# EAGLE design ProtoOne-v1 (EAGLE 7.3.0)
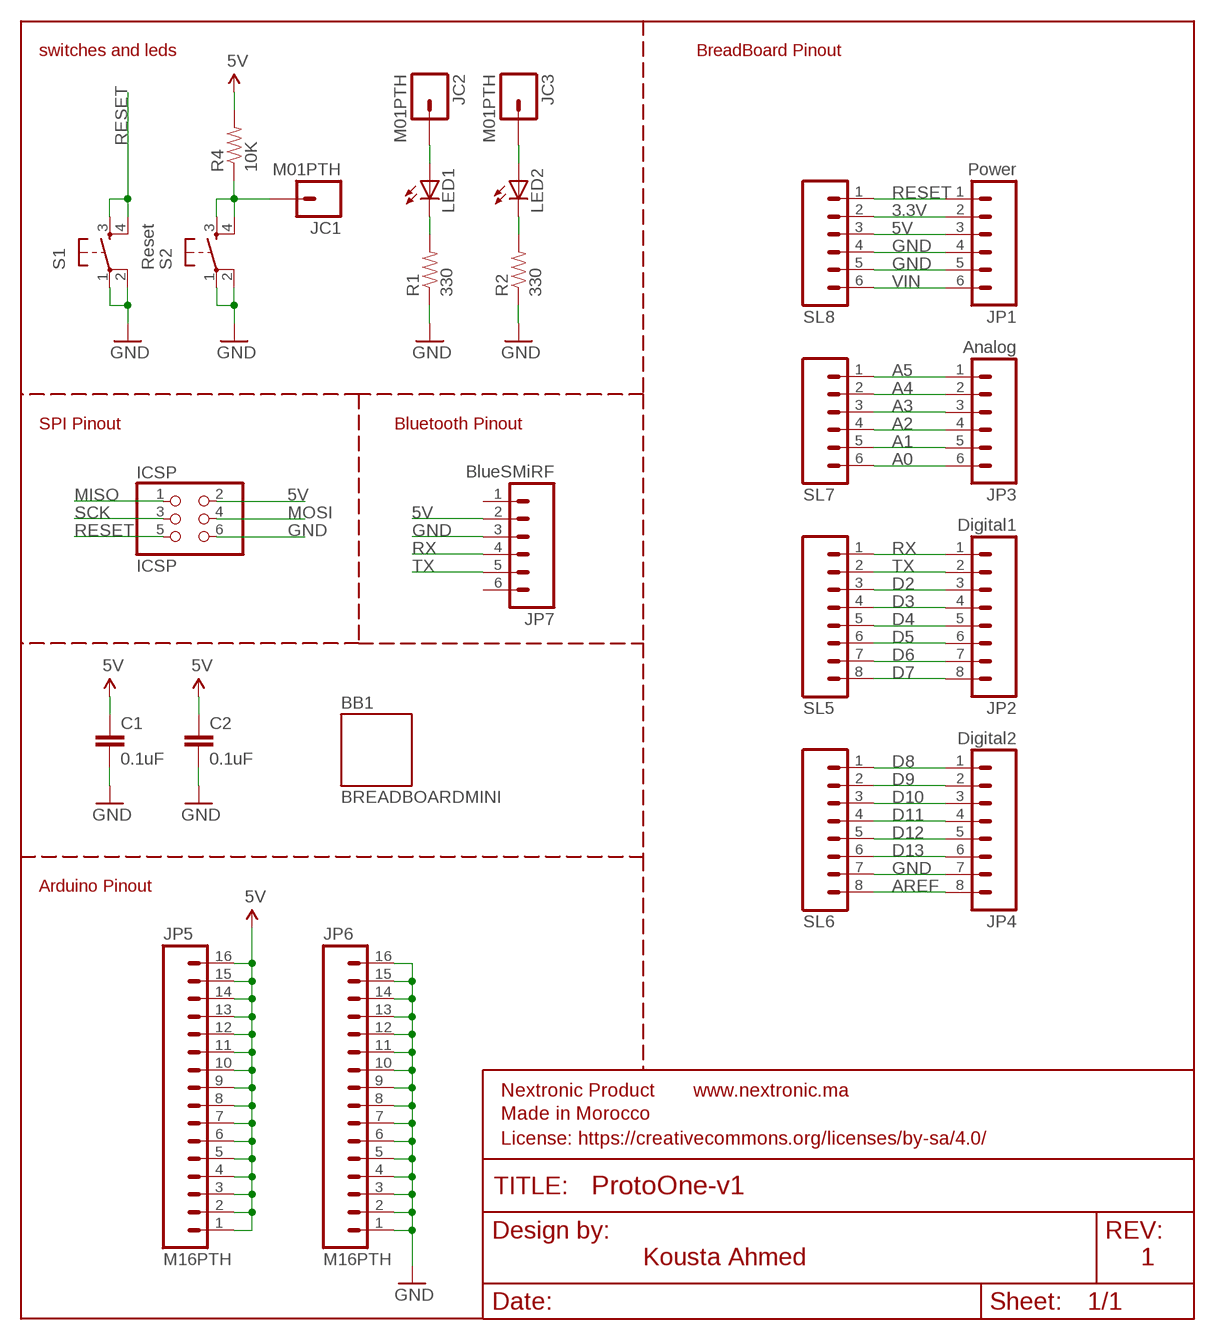
[diagram p0: schematic, sheet 1]

## Parts
BB1  BREADBOARDMINI  [BREADBOARD-MINI]
C1  0.1uF  CAPPTH2  [CAP-PTH-SMALL2]
C2  0.1uF  CAPPTH2  [CAP-PTH-SMALL2]
FRAME1  FRAME-LETTER  [CREATIVE_COMMONS]
ICSP  ICSP  PINHD-2X3  [2X03]
JC1  M01PTH  [1X01]
JC2  M01PTH  [1X01]
JC3  M01PTH  [1X01]
JP1  Power  M06SIP  [1X06]
JP2  Digital1  M08  [1X08]
JP3  Analog  M06SIP  [1X06]
JP4  Digital2  M08  [1X08]
JP5  M16PTH  [1X16]
JP6  M16PTH  [1X16]
JP7  BlueSMiRF  M06SIP  [1X06]
LED1  LED5MM  [LED5MM]
LED2  LED5MM  [LED5MM]
R1  330  RESISTORPTH1  [AXIAL-0.3]
R2  330  RESISTORPTH1  [AXIAL-0.3]
R4  10K  RESISTORPTH1  [AXIAL-0.3]
S1  Reset  TAC_SWITCHPTH  [TACTILE-PTH]
S2  TAC_SWITCHPTH  [TACTILE-PTH]
SL5  M08  [1X08]
SL6  M08  [1X08]
SL7  M06SIP  [1X06]
SL8  M06SIP  [1X06]

## Nets
3.3V: JP1.2 SL8.2
5V [power]: C1.1 C2.1 ICSP.2 JP1.3 JP5.1 JP5.2 JP5.3 JP5.4 JP5.5 JP5.6 JP5.7 JP5.8 JP5.9 JP5.10 JP5.11 JP5.12 JP5.13 JP5.14 JP5.15 JP5.16 JP7.2 R4.P$2 SL8.3
A0: JP3.6 SL7.6
A1: JP3.5 SL7.5
A2: JP3.4 SL7.4
A3: JP3.3 SL7.3
A4: JP3.2 SL7.2
A5: JP3.1 SL7.1
AREF: JP4.8 SL6.8
D2: JP2.3 SL5.3
D3: JP2.4 SL5.4
D4: JP2.5 SL5.5
D5: JP2.6 SL5.6
D6: JP2.7 SL5.7
D7: JP2.8 SL5.8
D8: JP4.1 SL6.1
D9: JP4.2 SL6.2
D10: JP4.3 SL6.3
D11: JP4.4 SL6.4
D12: JP4.5 SL6.5
D13: JP4.6 SL6.6
GND [power]: C1.2 C2.2 ICSP.6 JP1.4 JP1.5 JP4.7 JP6.1 JP6.2 JP6.3 JP6.4 JP6.5 JP6.6 JP6.7 JP6.8 JP6.9 JP6.10 JP6.11 JP6.12 JP6.13 JP6.14 JP6.15 JP6.16 JP7.3 R1.P$1 R2.P$1 S1.1 S1.2 S2.1 S2.2 SL6.7 SL8.4 SL8.5
MISO: ICSP.1
MOSI: ICSP.4
N$2: JC1.1 R4.P$1 S2.3 S2.4
N$6: LED1.K(C) R1.P$2
N$7: LED2.K(C) R2.P$2
N$8: JC2.1 LED1.A
N$9: JC3.1 LED2.A
RESET: ICSP.5 JP1.1 S1.3 S1.4 SL8.1
RX: JP2.1 JP7.4 SL5.1
SCK: ICSP.3
TX: JP2.2 JP7.5 SL5.2
VIN [power]: JP1.6 SL8.6
Unconnected: JP7.1 JP7.6

## Notes on the sheet
- switches and leds | BreadBoard Pinout
- SPI Pinout | Bluetooth Pinout
- Arduino Pinout
- Kousta Ahmed | 1

## Library data of the parts
BB1 = SparkFun:BREADBOARD: Breadboard Mini Self Adhesive This is the mechnical outline for the very small self adhesive breadboard from SparkFun Electronics. Good for very small proto areas. SKU : PRT-07916; OC_FARNELL: unknown
C1 C2 = SparkFun:CAP: Capacitor Standard 0603 ceramic capacitor, and 0.1" leaded capacitor.; MF: MULTICOMP; MPN: MC0805B104K500A5.08MM; OC_FARNELL: 2395773
FRAME1 = SparkFun-Aesthetics:FRAME-LETTER: Schematic Frame Standard 8.5x11 US Letter frame; OC_FARNELL: unknown
ICSP = pinhead:PINHD-2X3: PIN HEADER; OC_FARNELL: unknown
JC1-JC3 = SparkFun:M01: Header 1 Standard 1-pin 0.1" header. Use with straight break away headers (SKU : PRT-00116), right angle break away headers (PRT-00553), swiss pins (PRT-00743), machine pins (PRT-00117), and female headers (PRT-00115).; OC_FARNELL: unknown
JP1 JP3 JP7 SL7 SL8 = SparkFun:M06: Header 6 Standard 6-pin 0.1" header. Use with straight break away headers (SKU : PRT-00116), right angle break away headers (PRT-00553), swiss pins (PRT-00743), machine pins (PRT-00117), and female headers (PRT-00115). Molex polarized connector foot print use with SKU : PRT-08094 with associated crimp pins and housings. NOTES ON THE VARIANTS LOCK and LOCK_LONGPADS... This footprint was designed to help hold the alignment of a through-hole component (i.e. 6-pin header) while soldering it into place. You may notice that each hole has been shifted either up or down by 0.005 of an inch from it's more standard position (which is a perfectly straight line). This slight alteration caused the pins (the squares in the middle) to touch the edges of the holes. Because they are alternating, it causes a "brace" to hold the component in place. 0.005 has proven to be the perfect amount of "off-center" position when using our standard breakaway headers. Although looks a little odd when you look at the bare footprint, once you have a header in there, the alteration is very hard to notice. Also, if you push a header all the way into place, it is covered up entirely on the bottom side. This idea of altering the position of holes to aid alignment will be further integrated into the Sparkfun Library for other footprints. It can help hold any component with 3 or more connection pins.; OC_FARNELL: unknown
JP2 JP4 SL5 SL6 = SparkFun:M08: Header 8 Standard 8-pin 0.1" header. Use with straight break away headers (SKU : PRT-00116), right angle break away headers (PRT-00553), swiss pins (PRT-00743), machine pins (PRT-00117), and female headers (PRT-00115).; OC_FARNELL: unknown
JP5 JP6 = SparkFun:M16; OC_FARNELL: unknown
LED1 LED2 = SparkFun:LED: LEDs Standard schematic elements and footprints for 5mm, 3mm, 1206, and 0603 sized LEDs. 5mm - Spark Fun Electronics SKU : COM-00529 (and others); OC_FARNELL: unknown
R1 R2 = SparkFun:RESISTOR: Resistor Basic schematic elements and footprints for 0603, 1206, and PTH 1/10th watt (small) resistors.; OC_FARNELL: unknown
R4 = SparkFun:RESISTOR: Resistor Basic schematic elements and footprints for 0603, 1206, and PTH 1/10th watt (small) resistors.; MF: SUSUMU; MPN: RR0816P-103-B-T5; OC_FARNELL: 1653253
S1 S2 = SparkFun:TAC_SWITCH: Momentary Switch Button commonly used for reset or general input. Spark Fun Electronics SKU : COM-00097; OC_FARNELL: unknown

## Net classes
1 power: width 0.254 mm

## Board
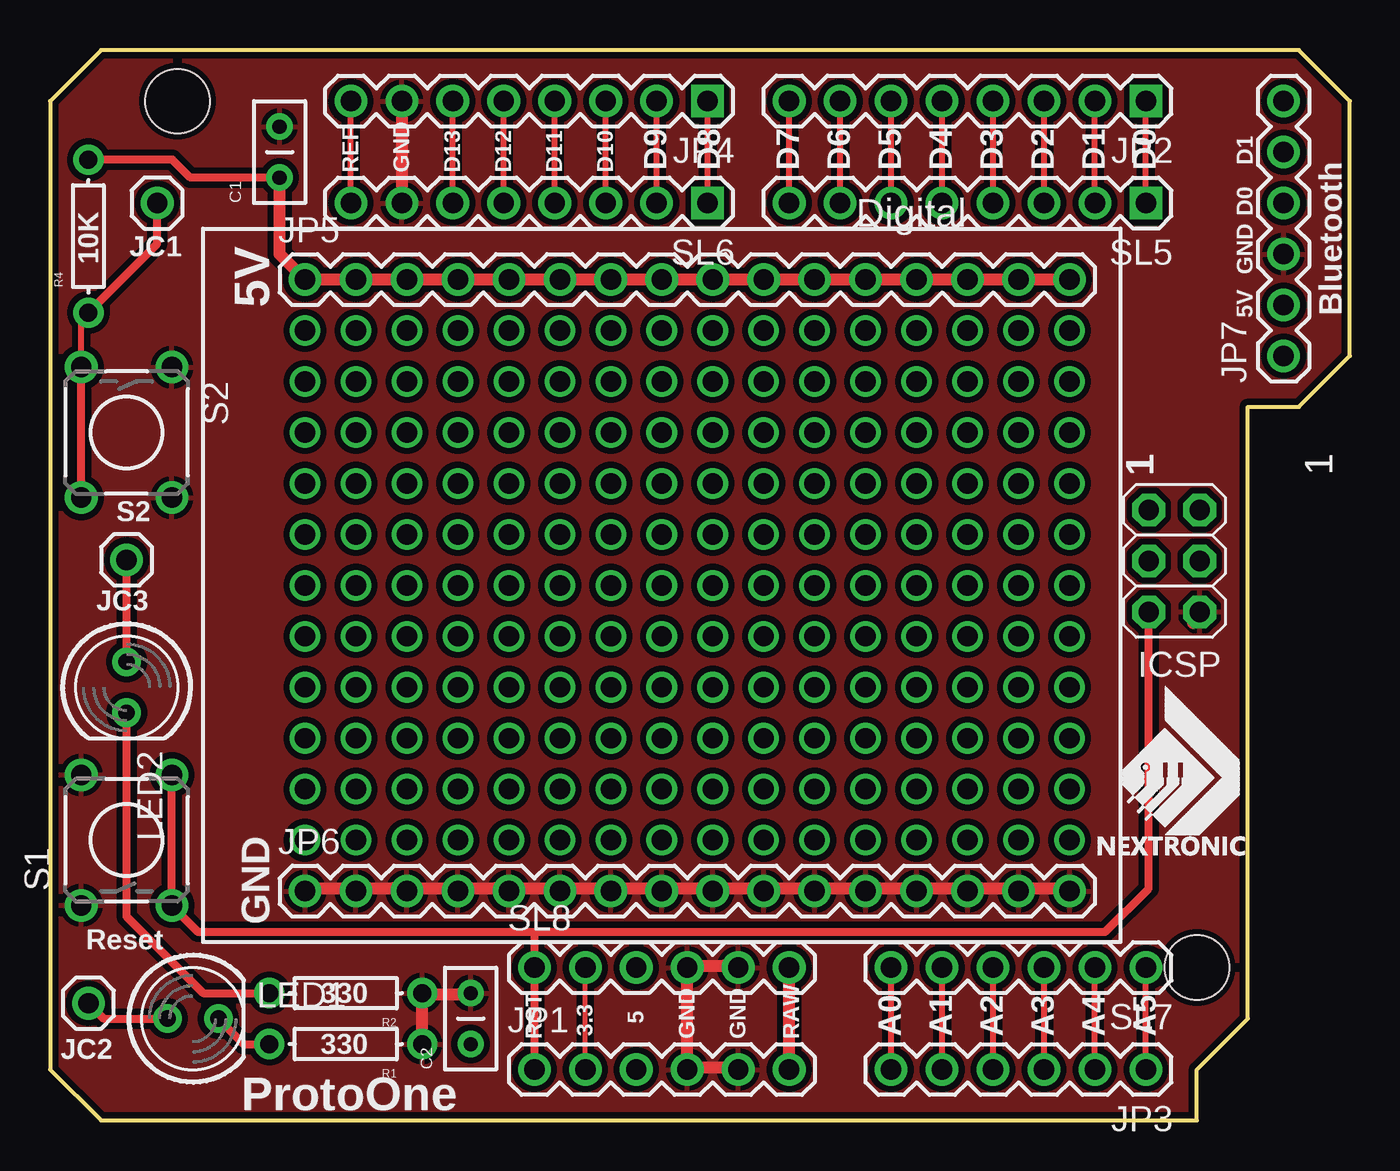
[diagram p1: board, top side]
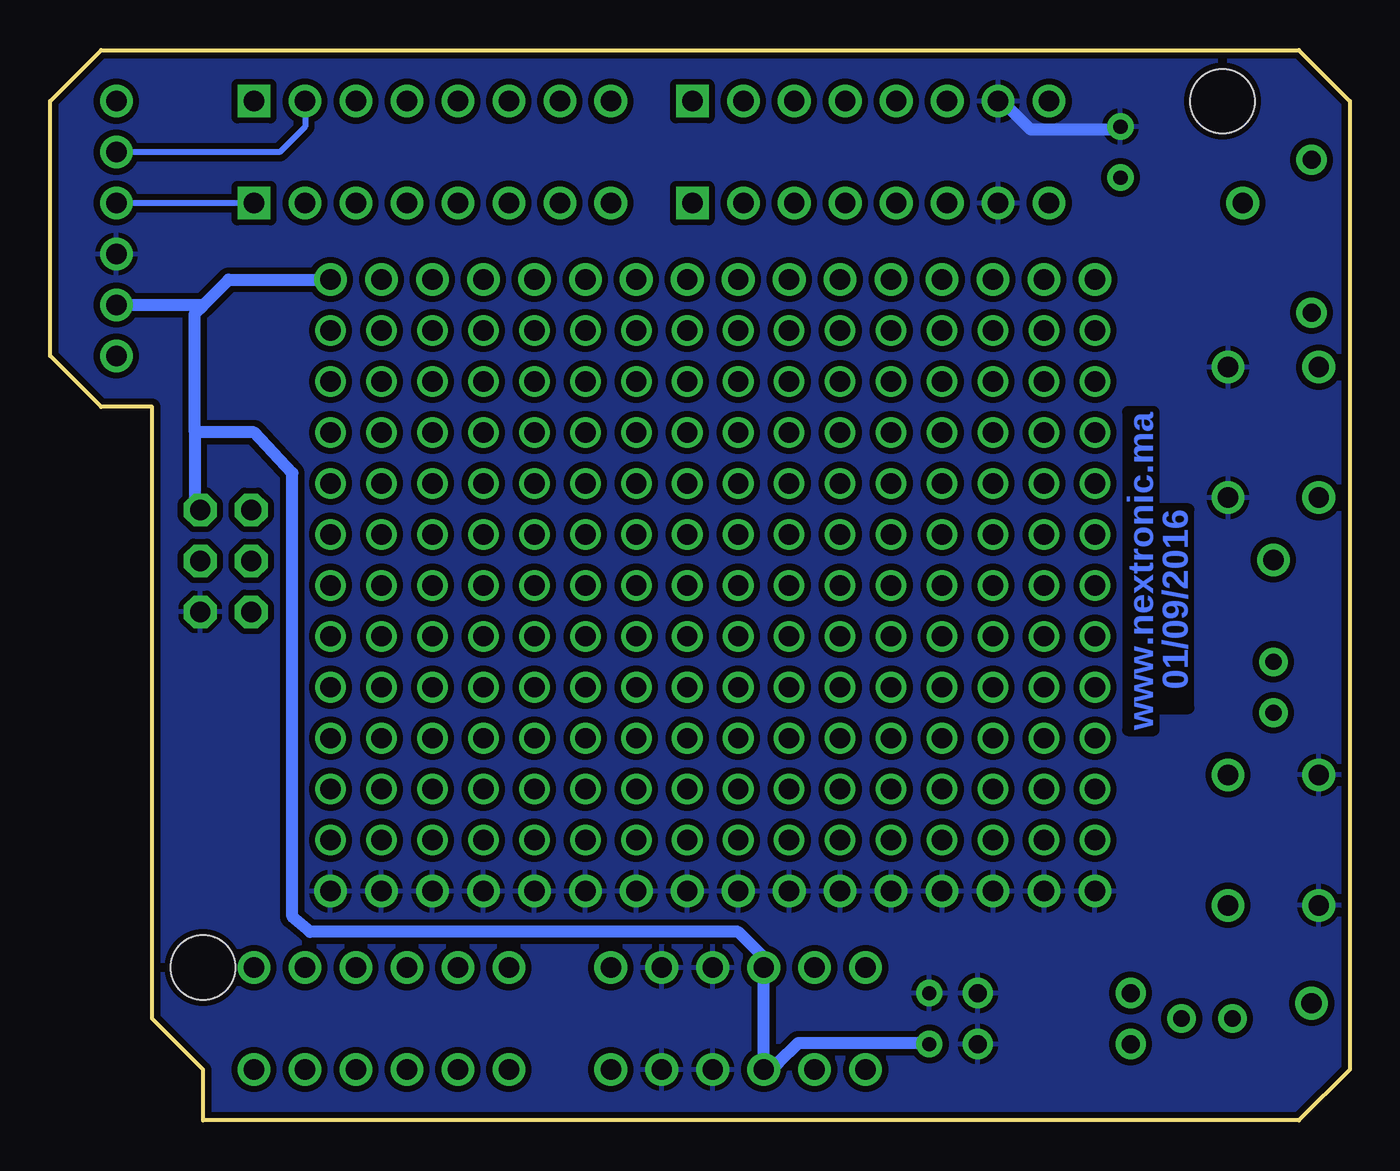
[diagram p2: board, bottom side, seen from below]

Size 64.77 x 53.34 mm. Coordinates in mm from the lower left corner, seen from the top.
Outline: 0,50.8 0,2.54 2.54,0 57.15,0 57.15,2.54 59.69,5.08 59.69,35.56 62.23,35.56 64.77,38.1 64.77,50.8 62.23,53.34 2.54,53.34 0,50.8
Copper layers (1*16): Top 0.035mm / dielectric 1.5mm / Bottom 0.035mm
Design rules "SparkFun": minimum track width 8mil, minimum drill 20mil, track to track 8mil, track to pad 8mil, pad to pad 8mil, via to via 8mil, smd to smd 8mil, copper to edge 10mil, drill to drill 8mil, minimum pad ring 12mil, minimum via ring 10mil, stop-mask expansion 4mil, vias tented up to drill 20mil, thermal gap 10mil
Holes 3.2 mm at 57.15,7.62 6.35,50.8

### Footprints (pad centres in the part's own frame; a part is rotated, then mirrored left to right if it is on the bottom)
CAP-PTH-SMALL2 = drill 0.7: 1 0,0; 2 2.54,0
2X03 = drill 1.016 octagon: 1 -2.54,-1.27; 2 -2.54,1.27; 3 0,-1.27; 4 0,1.27; 5 2.54,-1.27; 6 2.54,1.27
1X01 = drill 1.016: 1 0,0
1X06 = drill 1.016: 1 0,0; 2 2.54,0; 3 5.08,0; 4 7.62,0; 5 10.16,0; 6 12.7,0
1X08 = drill 1.016 square: 1 0,0 | drill 1.016: 2 2.54,0; 3 5.08,0; 4 7.62,0; 5 10.16,0; 6 12.7,0; 7 15.24,0; 8 17.78,0
1X16 = drill 1.016: 1 0,0; 2 2.54,0; 3 5.08,0; 4 7.62,0; 5 10.16,0; 6 12.7,0; 7 15.24,0; 8 17.78,0; 9 20.32,0; 10 22.86,0; 11 25.4,0; 12 27.94,0; 13 30.48,0; 14 33.02,0; 15 35.56,0; 16 38.1,0
LED5MM = drill 0.813: A -1.27,0; K 1.27,0
AXIAL-0.3 = drill 0.9: P$1 -3.81,0; P$2 3.81,0
TACTILE-PTH = drill 1.016: 1 -3.251,2.261; 2 3.251,2.261; 3 -3.251,-2.261; 4 3.251,-2.261

### Placement (x,y rotation side)
BB1  7.62,8.89 0 top
C1  11.43,46.99 90 top
C2  20.95,3.81 90 top
FRAME1  -1.27,-1.27 0 top
ICSP  56.02,27.89 270 top
JC1  5.33,45.72 0 top
JC2  1.9,5.84 90 top
JC3  3.81,27.94 270 top
JP1  24.13,2.54 0 top
JP2  54.61,50.8 180 top
JP3  54.61,2.54 180 top
JP4  32.77,50.8 180 top
JP5  12.7,41.91 0 top
JP6  12.7,11.43 0 top
JP7  61.47,38.1 90 top
LED1  7.11,5.08 0 top
LED2  3.81,21.59 270 top
R1  14.73,3.81 180 top
R2  14.73,6.35 180 top
R4  1.9,44.07 90 top
S1  3.81,13.97 90 top
S2  3.81,34.29 270 top
SL5  54.61,45.72 180 top
SL6  32.77,45.72 180 top
SL7  54.61,7.62 180 top
SL8  24.13,7.62 0 top

### Tracks (layer width: path | path; a pad name or v marks a point on that pad's centre or on a via)
3.3V
  Top 0.254: JP1.2 SL8.2
5V
  Top 0.406: C1.1 6.98,46.99 6.1,47.88 R4.P$2
  Top 0.61: JP5.16 JP5.15 JP5.14 JP5.13 JP5.12 JP5.11 JP5.10 JP5.9 JP5.8 JP5.7 JP5.6 JP5.5 JP5.4 JP5.3 JP5.2 JP5.1 11.43,43.18 C1.1
  Bottom 0.61: C2.1 21.39,3.86 27.48,3.86 28.5,2.85 JP1.3 SL8.3 29.21,8.13 30.48,9.4 51.82,9.4 52.7,10.16 52.7,32.26 54.61,34.29 57.56,34.29 | 57.56,34.29 57.56,40.23 57.15,40.64 | 57.56,34.29 57.56,31.09 ICSP.2 | JP5.16 55.88,41.91 57.15,40.64 | 57.15,40.64 JP7.2
A0
  Top 0.305: JP3.6 SL7.6
A1
  Top 0.305: JP3.5 SL7.5
A2
  Top 0.305: JP3.4 SL7.4
A3
  Top 0.305: JP3.3 SL7.3
A4
  Top 0.305: JP3.2 SL7.2
A5
  Top 0.305: JP3.1 SL7.1
AREF
  Top 0.305: SL6.8 JP4.8
D2
  Top 0.305: SL5.3 JP2.3
D3
  Top 0.305: SL5.4 JP2.4
D4
  Top 0.305: SL5.5 JP2.5
D5
  Top 0.305: SL5.6 JP2.6
D6
  Top 0.305: SL5.7 JP2.7
D7
  Top 0.305: SL5.8 JP2.8
D8
  Top 0.305: SL6.1 JP4.1
D9
  Top 0.305: SL6.2 JP4.2
D10
  Top 0.305: SL6.3 JP4.3
D11
  Top 0.305: SL6.4 JP4.4
D12
  Top 0.305: SL6.5 JP4.5
D13
  Top 0.305: SL6.6 JP4.6
GND
  Top 0.61: JP6.16 50.24,11.58 48.82,11.58 JP6.15 47.6,11.58 46.38,11.58 JP6.14 45.16,11.58 43.74,11.58 JP6.13 42.52,11.58 41.3,11.58 JP6.12 40.08,11.58 38.66,11.58 JP6.11 37.44,11.58 36.22,11.58 JP6.10 35,11.58 33.58,11.58 JP6.9 32.36,11.58 31.14,11.58 JP6.8 29.92,11.58 28.5,11.58 JP6.7 27.28,11.58 26.06,11.58 JP6.6 24.84,11.58 23.42,11.58 JP6.5 22.2,11.58 20.98,11.58 JP6.4 19.76,11.58 18.34,11.58 JP6.3 17.12,11.58 15.9,11.58 JP6.2 14.68,11.58 13.26,11.58 JP6.1 | 56.95,24.79 ICSP.6 | JP4.7 SL6.7 | JP1.5 33.58,2.64 32.36,2.64 JP1.4 SL8.4 32.36,7.72 33.58,7.72 SL8.5 | C2.2 20.37,6.3 19.15,6.3 R2.P$1 R1.P$1
  Bottom 0.61: C1.2 11.84,49.38 15.9,49.38 16.92,50.39 JP4.7
  pour Bottom (isolate 0.305): 64.77,53.34 64.77,0 0,0 0,53.34
  pour Top (isolate 0.305): 64.77,53.34 64.77,0 0,0 0,53.34
N$2
  Top 0.305: S2.3 1.55,39.9 R4.P$1
  Top 0.406: S2.4 S2.3 | JC1.1 5.33,43.69 R4.P$1
N$3  (via drill 1.02)
  other vias: 50.8,39.37
N$4  (via drill 1.02)
  other vias: 50.8,36.83
N$5  (via drill 1.02)
  other vias: 50.8,13.97
N$6
  Top 0.406: LED1.K 9.65,3.81 R1.P$2
N$7
  Top 0.406: LED2.K 3.81,10.16 7.62,6.35 R2.P$2
N$8
  Top 0.406: LED1.A 2.67,5.08 JC2.1
N$9
  Top 0.406: LED2.A JC3.1
N$10  (via drill 1.02)
  other vias: 50.8,16.51
N$11  (via drill 1.02)
  other vias: 50.8,19.05
N$12  (via drill 1.02)
  other vias: 50.8,21.59
N$13  (via drill 1.02)
  other vias: 50.8,24.13
N$14  (via drill 1.02)
  other vias: 50.8,26.67
N$15  (via drill 1.02)
  other vias: 50.8,29.21
N$16  (via drill 1.02)
  other vias: 50.8,31.75
N$17  (via drill 1.02)
  other vias: 50.8,34.29
N$18  (via drill 1.02)
  other vias: 48.26,39.37
N$19  (via drill 1.02)
  other vias: 48.26,36.83
N$20  (via drill 1.02)
  other vias: 48.26,13.97
N$21  (via drill 1.02)
  other vias: 48.26,16.51
N$22  (via drill 1.02)
  other vias: 48.26,19.05
N$23  (via drill 1.02)
  other vias: 48.26,21.59
N$24  (via drill 1.02)
  other vias: 48.26,24.13
N$25  (via drill 1.02)
  other vias: 48.26,26.67
N$26  (via drill 1.02)
  other vias: 48.26,29.21
N$27  (via drill 1.02)
  other vias: 48.26,31.75
N$28  (via drill 1.02)
  other vias: 48.26,34.29
N$29  (via drill 1.02)
  other vias: 45.72,39.37
N$30  (via drill 1.02)
  other vias: 45.72,36.83
N$31  (via drill 1.02)
  other vias: 45.72,13.97
N$32  (via drill 1.02)
  other vias: 45.72,16.51
N$33  (via drill 1.02)
  other vias: 45.72,19.05
N$34  (via drill 1.02)
  other vias: 45.72,21.59
N$35  (via drill 1.02)
  other vias: 45.72,24.13
N$36  (via drill 1.02)
  other vias: 45.72,26.67
N$37  (via drill 1.02)
  other vias: 45.72,29.21
N$38  (via drill 1.02)
  other vias: 45.72,31.75
N$39  (via drill 1.02)
  other vias: 45.72,34.29
N$40  (via drill 1.02)
  other vias: 43.18,39.37
N$41  (via drill 1.02)
  other vias: 43.18,36.83
N$42  (via drill 1.02)
  other vias: 43.18,13.97
N$43  (via drill 1.02)
  other vias: 43.18,16.51
N$44  (via drill 1.02)
  other vias: 43.18,19.05
N$45  (via drill 1.02)
  other vias: 43.18,21.59
N$46  (via drill 1.02)
  other vias: 43.18,24.13
N$47  (via drill 1.02)
  other vias: 43.18,26.67
N$48  (via drill 1.02)
  other vias: 43.18,29.21
N$49  (via drill 1.02)
  other vias: 43.18,31.75
N$50  (via drill 1.02)
  other vias: 43.18,34.29
N$51  (via drill 1.02)
  other vias: 40.64,39.37
N$52  (via drill 1.02)
  other vias: 40.64,36.83
N$53  (via drill 1.02)
  other vias: 40.64,13.97
N$54  (via drill 1.02)
  other vias: 40.64,16.51
N$55  (via drill 1.02)
  other vias: 40.64,19.05
N$56  (via drill 1.02)
  other vias: 40.64,21.59
N$57  (via drill 1.02)
  other vias: 40.64,24.13
N$58  (via drill 1.02)
  other vias: 40.64,26.67
N$59  (via drill 1.02)
  other vias: 40.64,29.21
N$60  (via drill 1.02)
  other vias: 40.64,31.75
N$61  (via drill 1.02)
  other vias: 40.64,34.29
N$62  (via drill 1.02)
  other vias: 38.1,39.37
N$63  (via drill 1.02)
  other vias: 38.1,36.83
N$64  (via drill 1.02)
  other vias: 38.1,13.97
N$65  (via drill 1.02)
  other vias: 38.1,16.51
N$66  (via drill 1.02)
  other vias: 38.1,19.05
N$67  (via drill 1.02)
  other vias: 38.1,21.59
N$68  (via drill 1.02)
  other vias: 38.1,24.13
N$69  (via drill 1.02)
  other vias: 38.1,26.67
N$70  (via drill 1.02)
  other vias: 38.1,29.21
N$71  (via drill 1.02)
  other vias: 38.1,31.75
N$72  (via drill 1.02)
  other vias: 38.1,34.29
N$73  (via drill 1.02)
  other vias: 35.56,39.37
N$74  (via drill 1.02)
  other vias: 35.56,36.83
N$75  (via drill 1.02)
  other vias: 35.56,13.97
N$76  (via drill 1.02)
  other vias: 35.56,16.51
N$77  (via drill 1.02)
  other vias: 35.56,19.05
N$78  (via drill 1.02)
  other vias: 35.56,21.59
N$79  (via drill 1.02)
  other vias: 35.56,24.13
N$80  (via drill 1.02)
  other vias: 35.56,26.67
N$81  (via drill 1.02)
  other vias: 35.56,29.21
N$82  (via drill 1.02)
  other vias: 35.56,31.75
N$83  (via drill 1.02)
  other vias: 35.56,34.29
N$84  (via drill 1.02)
  other vias: 33.02,39.37
N$85  (via drill 1.02)
  other vias: 33.02,36.83
N$86  (via drill 1.02)
  other vias: 33.02,13.97
N$87  (via drill 1.02)
  other vias: 33.02,16.51
N$88  (via drill 1.02)
  other vias: 33.02,19.05
N$89  (via drill 1.02)
  other vias: 33.02,21.59
N$90  (via drill 1.02)
  other vias: 33.02,24.13
N$91  (via drill 1.02)
  other vias: 33.02,26.67
N$92  (via drill 1.02)
  other vias: 33.02,29.21
N$93  (via drill 1.02)
  other vias: 33.02,31.75
N$94  (via drill 1.02)
  other vias: 33.02,34.29
N$95  (via drill 1.02)
  other vias: 30.48,39.37
N$96  (via drill 1.02)
  other vias: 30.48,36.83
N$97  (via drill 1.02)
  other vias: 30.48,13.97
N$98  (via drill 1.02)
  other vias: 30.48,16.51
N$99  (via drill 1.02)
  other vias: 30.48,19.05
N$100  (via drill 1.02)
  other vias: 30.48,21.59
N$101  (via drill 1.02)
  other vias: 30.48,24.13
N$102  (via drill 1.02)
  other vias: 30.48,26.67
N$103  (via drill 1.02)
  other vias: 30.48,29.21
N$104  (via drill 1.02)
  other vias: 30.48,31.75
N$105  (via drill 1.02)
  other vias: 30.48,34.29
N$106  (via drill 1.02)
  other vias: 27.94,39.37
N$107  (via drill 1.02)
  other vias: 27.94,36.83
N$108  (via drill 1.02)
  other vias: 27.94,13.97
N$109  (via drill 1.02)
  other vias: 27.94,16.51
N$110  (via drill 1.02)
  other vias: 27.94,19.05
N$111  (via drill 1.02)
  other vias: 27.94,21.59
N$112  (via drill 1.02)
  other vias: 27.94,24.13
N$113  (via drill 1.02)
  other vias: 27.94,26.67
N$114  (via drill 1.02)
  other vias: 27.94,29.21
N$115  (via drill 1.02)
  other vias: 27.94,31.75
N$116  (via drill 1.02)
  other vias: 27.94,34.29
N$117  (via drill 1.02)
  other vias: 25.4,39.37
N$118  (via drill 1.02)
  other vias: 25.4,36.83
N$119  (via drill 1.02)
  other vias: 25.4,13.97
N$120  (via drill 1.02)
  other vias: 25.4,16.51
N$121  (via drill 1.02)
  other vias: 25.4,19.05
N$122  (via drill 1.02)
  other vias: 25.4,21.59
N$123  (via drill 1.02)
  other vias: 25.4,24.13
N$124  (via drill 1.02)
  other vias: 25.4,26.67
N$125  (via drill 1.02)
  other vias: 25.4,29.21
N$126  (via drill 1.02)
  other vias: 25.4,31.75
N$127  (via drill 1.02)
  other vias: 25.4,34.29
N$128  (via drill 1.02)
  other vias: 22.86,39.37
N$129  (via drill 1.02)
  other vias: 22.86,36.83
N$130  (via drill 1.02)
  other vias: 22.86,13.97
N$131  (via drill 1.02)
  other vias: 22.86,16.51
N$132  (via drill 1.02)
  other vias: 22.86,19.05
N$133  (via drill 1.02)
  other vias: 22.86,21.59
N$134  (via drill 1.02)
  other vias: 22.86,24.13
N$135  (via drill 1.02)
  other vias: 22.86,26.67
N$136  (via drill 1.02)
  other vias: 22.86,29.21
N$137  (via drill 1.02)
  other vias: 22.86,31.75
N$138  (via drill 1.02)
  other vias: 22.86,34.29
N$139  (via drill 1.02)
  other vias: 20.32,39.37
N$140  (via drill 1.02)
  other vias: 20.32,36.83
N$141  (via drill 1.02)
  other vias: 20.32,13.97
N$142  (via drill 1.02)
  other vias: 20.32,16.51
N$143  (via drill 1.02)
  other vias: 20.32,19.05
N$144  (via drill 1.02)
  other vias: 20.32,21.59
N$145  (via drill 1.02)
  other vias: 20.32,24.13
N$146  (via drill 1.02)
  other vias: 20.32,26.67
N$147  (via drill 1.02)
  other vias: 20.32,29.21
N$148  (via drill 1.02)
  other vias: 20.32,31.75
N$149  (via drill 1.02)
  other vias: 20.32,34.29
N$150  (via drill 1.02)
  other vias: 17.78,39.37
N$151  (via drill 1.02)
  other vias: 17.78,36.83
N$152  (via drill 1.02)
  other vias: 17.78,13.97
N$153  (via drill 1.02)
  other vias: 17.78,16.51
N$154  (via drill 1.02)
  other vias: 17.78,19.05
N$155  (via drill 1.02)
  other vias: 17.78,21.59
N$156  (via drill 1.02)
  other vias: 17.78,24.13
N$157  (via drill 1.02)
  other vias: 17.78,26.67
N$158  (via drill 1.02)
  other vias: 17.78,29.21
N$159  (via drill 1.02)
  other vias: 17.78,31.75
N$160  (via drill 1.02)
  other vias: 17.78,34.29
N$161  (via drill 1.02)
  other vias: 15.24,39.37
N$162  (via drill 1.02)
  other vias: 15.24,36.83
N$163  (via drill 1.02)
  other vias: 15.24,13.97
N$164  (via drill 1.02)
  other vias: 15.24,16.51
N$165  (via drill 1.02)
  other vias: 15.24,19.05
N$166  (via drill 1.02)
  other vias: 15.24,21.59
N$167  (via drill 1.02)
  other vias: 15.24,24.13
N$168  (via drill 1.02)
  other vias: 15.24,26.67
N$169  (via drill 1.02)
  other vias: 15.24,29.21
N$170  (via drill 1.02)
  other vias: 15.24,31.75
N$171  (via drill 1.02)
  other vias: 15.24,34.29
N$172  (via drill 1.02)
  other vias: 12.7,39.37
N$173  (via drill 1.02)
  other vias: 12.7,36.83
N$174  (via drill 1.02)
  other vias: 12.7,13.97
N$175  (via drill 1.02)
  other vias: 12.7,16.51
N$176  (via drill 1.02)
  other vias: 12.7,19.05
N$177  (via drill 1.02)
  other vias: 12.7,21.59
N$178  (via drill 1.02)
  other vias: 12.7,24.13
N$179  (via drill 1.02)
  other vias: 12.7,26.67
N$180  (via drill 1.02)
  other vias: 12.7,29.21
N$181  (via drill 1.02)
  other vias: 12.7,31.75
N$182  (via drill 1.02)
  other vias: 12.7,34.29
RESET
  Top 0.406: ICSP.5 54.75,25.39 54.74,25.4 54.74,11.56 52.58,9.4 24.13,9.4 | S1.4 S1.3 6.07,10.69 7.37,9.4 24.13,9.4 | 24.13,9.4 SL8.1 JP1.1
RX
  Top 0.305: SL5.1 JP2.1
  Bottom 0.305: SL5.1 JP7.4
TX
  Top 0.305: SL5.2 JP2.2
  Bottom 0.305: JP7.5 53.34,48.26 52.07,49.53 JP2.2
VIN
  Top 0.61: JP1.6 SL8.6

### Text on the board
Bottom: www.nextronic.ma | 01/09/2016
tPlace: REF | GND | D13 | D12 | D11 | D10 | D9 | D8 | D7 | D6 | D5 | D4 | D3 | D2 | D1 | D0 | D1 | D0 | JC1 | GND | 5V | 5V | Bluetooth | 1 | S2 | JC3 | GND | Reset | 5 | RST | 3.3 | GND | GND | RAW | A0 | A1 | A2 | A3 | A4 | A5 | JC2 | ProtoOne
tNames: Digital | 1